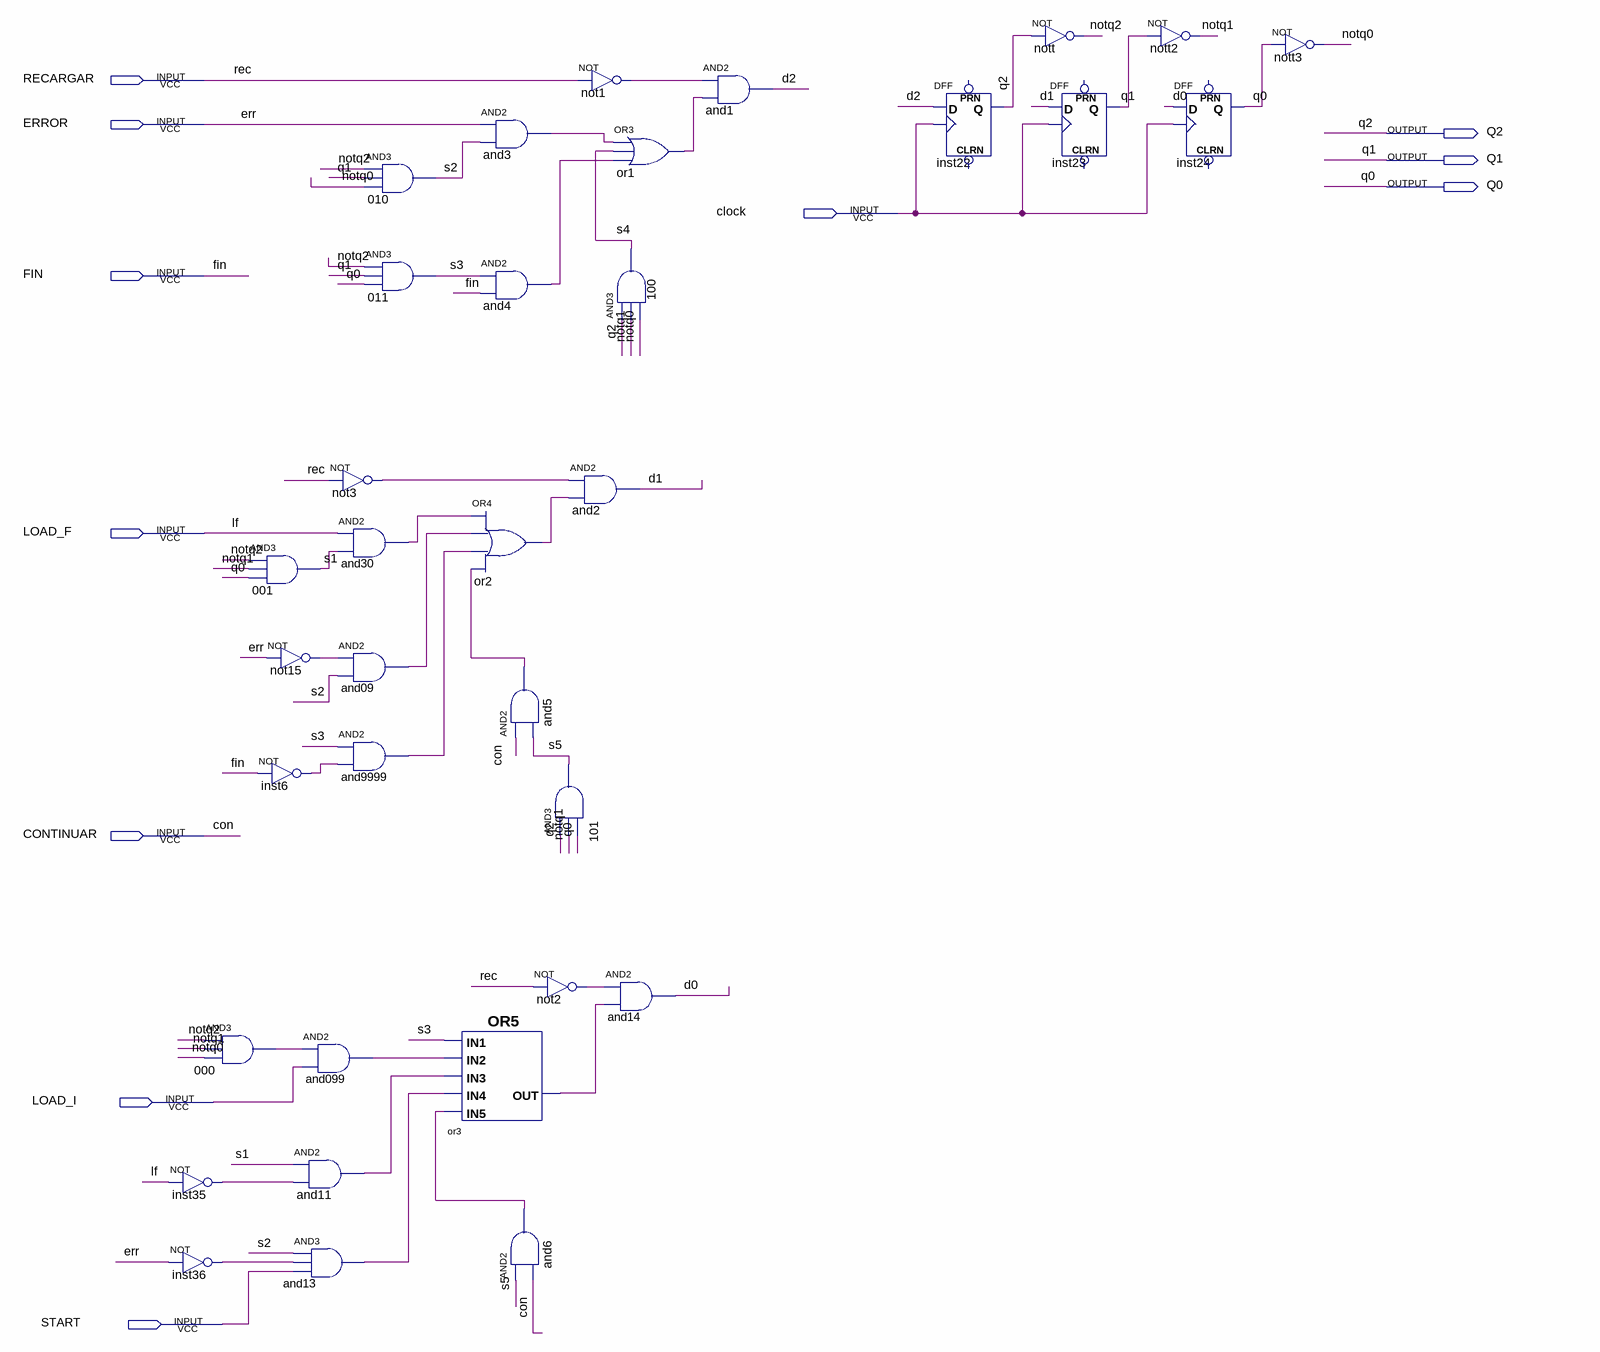
[diagram p0: schematic sheet]
// Quartus schematic maquina.bdf as structural Verilog: 35 symbols, 11 pins
module maquina (
  input  RECARGAR,
  input  ERROR,
  input  clock,
  input  FIN,
  input  LOAD_F,
  input  CONTINUAR,
  input  LOAD_I,
  input  START,
  output Q2,
  output Q1,
  output Q0
);

  wire and3_out, and4_out, and5_out, and6_out, and09_out, and11_out, and13_out, and30_out, and099_out,
       and9999_out, d0, d1, d2, inst6_out, inst35_out, inst36_out, n000_out, not1_out, not2_out, not3_out,
       not15_out, notq0, notq1, notq2, or1_out, or2_out, or3_out, s1, s2, s3, s4, s5;

  and u_000 (n000_out, notq2, notq1, notq0);
  not inst35 (inst35_out, LOAD_F);
  not inst36 (inst36_out, ERROR);
  and u_001 (s1, notq2, notq1, Q0);
  not not15 (not15_out, ERROR);
  not inst6 (inst6_out, FIN);
  and and11 (and11_out, s1, inst35_out);
  and and13 (and13_out, s2, inst36_out, START);
  and u_010 (s2, notq2, Q1, notq0);
  and u_011 (s3, notq2, Q1, Q0);
  not not3 (not3_out, RECARGAR);
  and and30 (and30_out, LOAD_F, s1);
  and and09 (and09_out, not15_out, s2);
  and and9999 (and9999_out, s3, inst6_out);
  and and099 (and099_out, n000_out, LOAD_I);
  and and3 (and3_out, ERROR, s2);
  and and4 (and4_out, s3, FIN);
  or or2 (or2_out, and30_out, and09_out, and9999_out, and5_out);
  and and5 (and5_out, CONTINUAR, s5);
  or or3 (or3_out, s3, and099_out, and11_out, and13_out, and6_out);
  and and6 (and6_out, s5, CONTINUAR);
  not not1 (not1_out, RECARGAR);
  and and2 (d1, not3_out, or2_out);
  and u_101 (s5, Q2, notq1, Q0);
  not not2 (not2_out, RECARGAR);
  or or1 (or1_out, and3_out, s4, and4_out);
  and u_100 (s4, Q2, notq1, notq0);
  and and14 (d0, not2_out, or3_out);
  and and1 (d2, not1_out, or1_out);
  DFF inst22 (.CLK(clock), .D(d2), .Q(Q2));  // open: CLRN, PRN
  not nott (notq2, Q2);
  DFF inst23 (.CLK(clock), .D(d1), .Q(Q1));  // open: CLRN, PRN
  not nott2 (notq1, Q1);
  DFF inst24 (.CLK(clock), .D(d0), .Q(Q0));  // open: CLRN, PRN
  not nott3 (notq0, Q0);

  // Other names for the same wires on the sheet: con = CONTINUAR; err = ERROR; lf = LOAD_F; rec = RECARGAR
endmodule
